# Altium schematic sheet External connections.SchDoc: External Connections Section
size A4; DrawnBy: Avishka C. Herath; DocumentNumber: EN2160 #3; Revision: 1.12; SheetNumber: 3; SheetTotal: 3; Project: RFID Access Control System
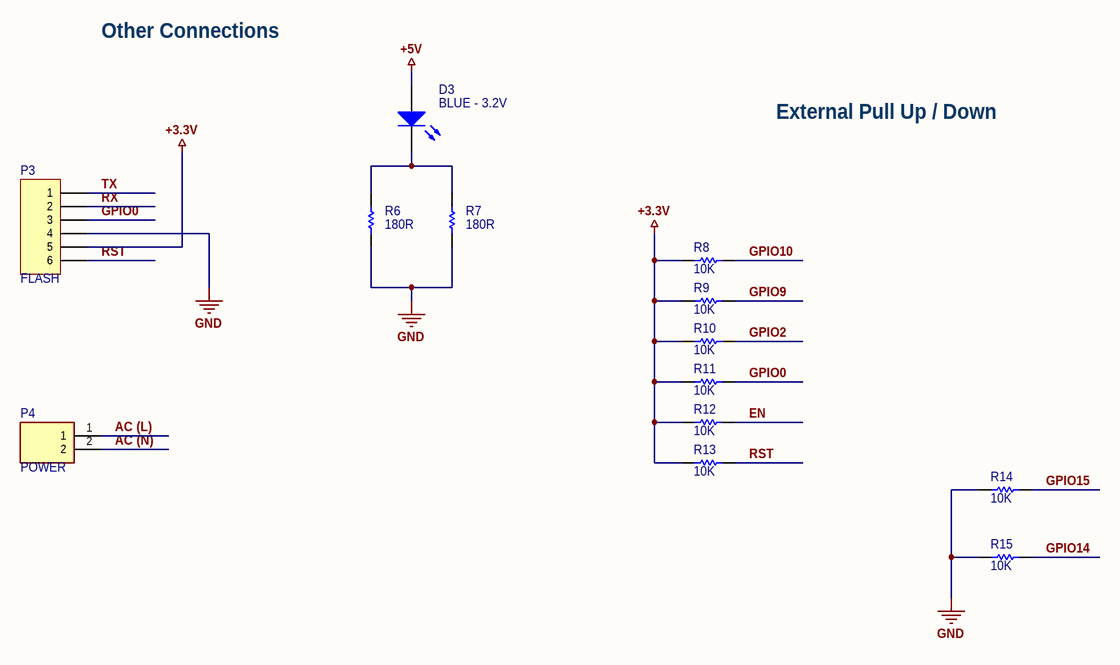
[diagram p0: External connections.SchDoc]

## Parts
D3  BLUE - 3.2V  [3528]
P3  FLASH  [My_1X06]
P4  POWER  [TB00250002BE]
R6  180R  [RESC2013X60X35ML10T20]
R7  180R  [RESC2013X60X35ML10T20]
R8  10K  [RESC2013X60X35ML10T20]
R9  10K  [RESC2013X60X35ML10T20]
R10  10K  [RESC2013X60X35ML10T20]
R11  10K  [RESC2013X60X35ML10T20]
R12  10K  [RESC2013X60X35ML10T20]
R13  10K  [RESC2013X60X35ML10T20]
R14  10K  [RESC2013X60X35ML10T20]
R15  10K  [RESC2013X60X35ML10T20]

## Nets
+3.3V: P3.5 R8.2 R9.2 R10.2 R11.2 R12.1 R13.1
+5V: D3.2(A)
GND: P3.4 R6.2 R7.2 R14.2 R15.2
AC (L): P4.1
AC (N): P4.2
EN: R12.2
GPIO0: P3.3 R11.1
GPIO2: R10.1
GPIO9: R9.1
GPIO10: R8.1
GPIO14: R15.1
GPIO15: R14.1
RST: P3.6 R13.2
RX: P3.2
TX: P3.1
NetD3_1: D3.1(K) R6.1 R7.1

## Notes on the sheet
- Other Connections
- External Pull Up / Down
- Title:
- Size:
- Date:
- A4
- Document Number:
- Sheet
- Revision:
- of
- Project:
- Drawn By:

## Library data of the parts
D3 = CMP-1429-00005-1: SMD mono-color Top LED, WL-SMTW, Blue; PartNumber: 150141BS73100; Manufacturer: Wuerth Elektronik; ComponentLink2Description: Datasheet; ComponentLink1Description: Manufacturer URL; ComponentLink2URL: http://katalog.we-online.com/led/datasheet/150141BS73100.pdf; ComponentLink1URL: http://www.we-online.com; PackageReference: 3528; Color: Blue
P3 = Header 6: Header, 6-Pin; ASiD Part Number: Header 6-AS
P4 = TB002-500-02BE: Connector; Manufacturer_Name: CUI Devices; Datasheet Link: https://eu.mouser.com/datasheet/2/670/tb002_500-1550579.pdf; Height: 10.4mm; Manufacturer_Part_Number: TB002-500-02BE; Mouser Part Number: 490-TB002-500-02BE; Mouser Price/Stock: https://www.mouser.co.uk/ProductDetail/CUI-Devices/TB002-500-02BE?qs=vLWxofP3U2x9716kcgva%2Fw%3D%3D; Arrow Part Number: TB002-500-02BE; Arrow Price/Stock: https://www.arrow.com/en/products/tb002-500-02be/cui-devices?region=nac
R6 R7 = CMP-009-00179-1: Res Thick Film 0805 180R Ohm 1% 0.125W(1/8W) +/-100ppm/C Epoxy Pad SMD T/R
R8-R15 = CMP-009-00179-1: Res Thick Film 0805 10K Ohm 1% 0.125W(1/8W) +/-100ppm/C Epoxy Pad SMD T/R